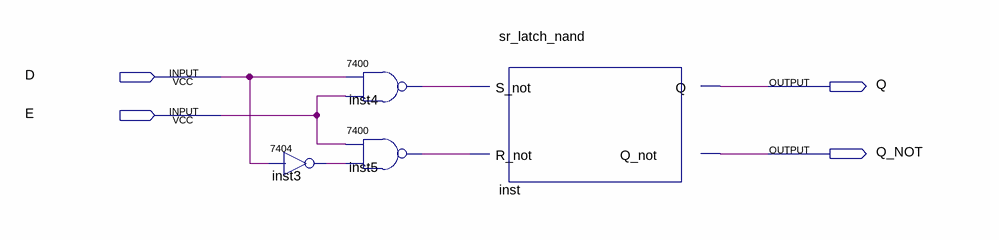
[diagram p0: schematic sheet]
// Quartus schematic d_latch_nand.bdf as structural Verilog: 4 symbols, 4 pins
module d_latch_nand (
  input  D,
  input  E,
  output Q,
  output Q_NOT
);

  wire inst3_1, inst4_1, inst5_1;

  \7404  inst3 (.\2 (D), .\1 (inst3_1));
  \7400  inst4 (.\3 (E), .\2 (D), .\1 (inst4_1));
  \7400  inst5 (.\3 (inst3_1), .\2 (E), .\1 (inst5_1));
  sr_latch_nand inst (.S_not(inst4_1), .R_not(inst5_1), .Q(Q), .Q_not(Q_NOT));
endmodule
